# EAGLE design Switch-220v-HiLink-CC1101-AS07 (EAGLE 8.2.1)
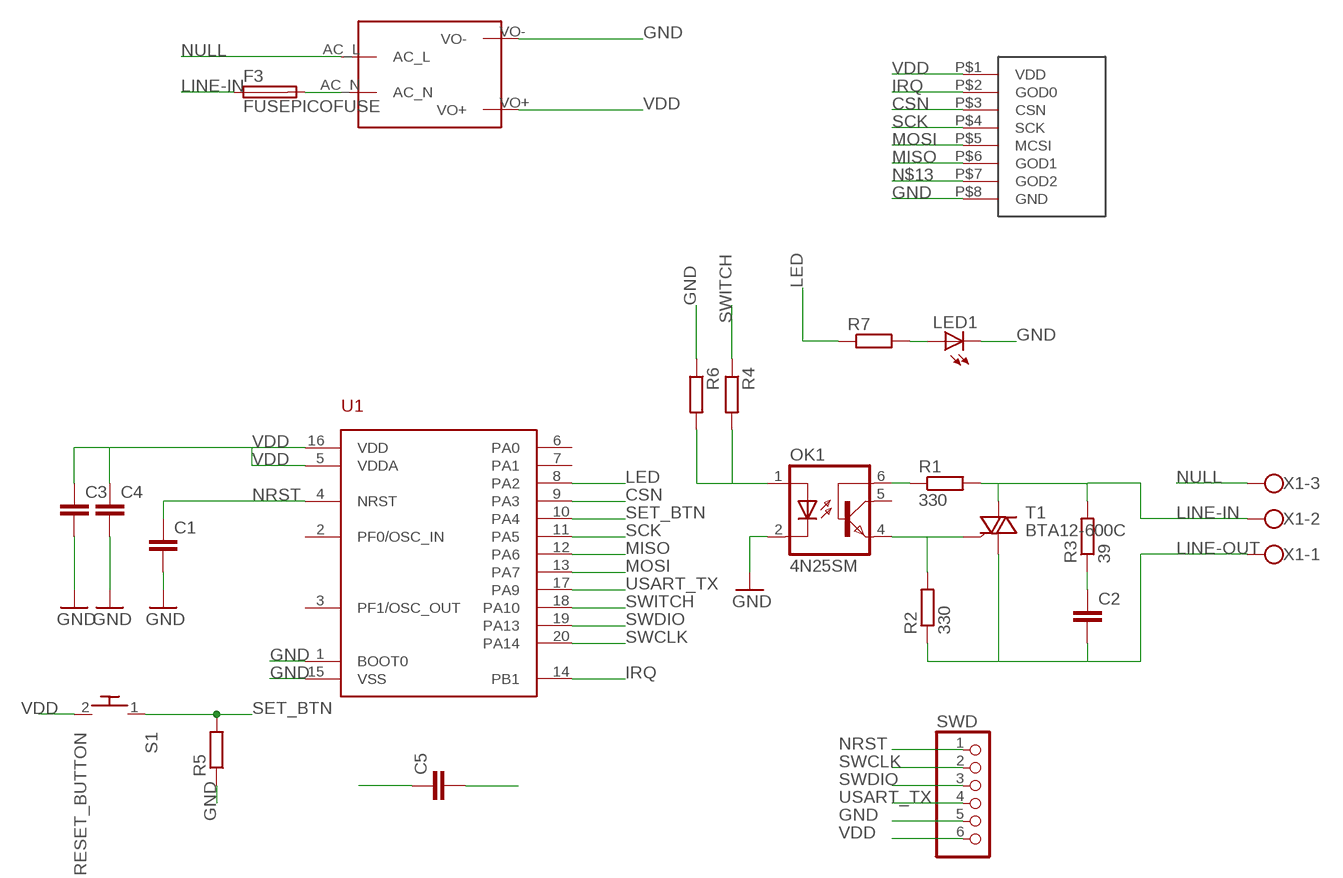
[diagram p0: schematic, sheet 1]

## Parts
C1  C-EUC0805  [C0805]
C2  C-EU050-025X075  [C050-025X075]
C3  C-EUC0805  [C0805]
C4  C-EUC0805  [C0805]
C5  C-EUC0805  [C0805]
F3  FUSEPICOFUSE  [PICOFUSE]
LED1  LEDCHIP-LED0805  [CHIP-LED0805]
OK1  4N25SM  [DIL6-SMD]
R1  330  R-EU_0207/2V  [0207/2V]
R2  330  R-EU_0204/7  [0204/7]
R3  39  R-EU_0204/7  [0204/7]
R4  R-EU_R0805  [R0805]
R5  R-EU_R0805  [R0805]
R6  R-EU_R0805  [R0805]
R7  R-EU_R0805  [R0805]
S1  RESET_BUTTON  [EVQ-PJU05K]
SWD  PINHD-1X6B  [1X06-BIG]
T1  BTA12-600C  [TO220DS]
U1  STM32F030F4  [TSSOP20]
U$2  MAINS_CONVERTERS  [HLK-PM01]
U$4  AS07-M1101SSMD  [AS07-M1101S-SMD]
X1  W237-103  [W237-103]

## Nets
CSN: U1.9(PA3) U$4.P$3(CSN)
GND: C1.2 C3.2 C4.2 C5.1 LED1.C OK1.2(C) R5.1 R6.1 SWD.5 U1.1(BOOT0) U1.15(VSS) U$2.VO- U$4.P$8(GND)
IRQ: U1.14(PB1) U$4.P$2(GOD0)
LED: R7.1 U1.8(PA2)
LINE-IN: F3.1 R1.2 R3.2 T1.A2 X1.2
LINE-OUT: C2.2 R2.1 T1.A1 X1.1
MISO: U1.12(PA6) U$4.P$6(GOD1)
MOSI: U1.13(PA7) U$4.P$5(MCSI)
N$1: OK1.4(EMI) R2.2 T1.G
N$2: OK1.6(BAS) R1.1
N$3: LED1.A R7.2
N$4: F3.2 U$2.AC_N
N$5: C2.1 R3.1
N$6: OK1.1(A) R4.2 R6.2
N$13: U$4.P$7(GOD2)
NRST: C1.1 SWD.1 U1.4(NRST)
NULL: U$2.AC_L X1.3
SCK: U1.11(PA5) U$4.P$4(SCK)
SET_BTN: R5.2 S1.1 U1.10(PA4)
SWCLK: SWD.2 U1.20(PA14)
SWDIO: SWD.3 U1.19(PA13)
SWITCH: R4.1 U1.18(PA10)
USART_TX: SWD.4 U1.17(PA9)
VDD: C3.1 C4.1 C5.2 S1.2 SWD.6 U1.5(VDDA) U1.16(VDD) U$2.VO+ U$4.P$1(VDD)
Unconnected: OK1.5(COL) U1.2(PF0/OSC_IN) U1.3(PF1/OSC_OUT) U1.6(PA0) U1.7(PA1)

## Library data of the parts
C1-C5 = resistor:C-EU: CAPACITOR, European symbol
F3 = fuse:FUSE: Fuse; OC_FARNELL: unknown; OC_NEWARK: unknown
LED1 = led:LED: LED OSRAM: - CHIPLED LG R971, LG N971, LY N971, LG Q971, LY Q971, LO R971, LY R971 LH N974, LH R974 LS Q976, LO Q976, LY Q976 LO Q996 - Hyper CHIPLED LW Q18S LB Q993, LB Q99A, LB R99A - SideLED LS A670, LO A670, LY A670, LG A670, LP A670 LB A673, LV A673, LT A673, LW A673 LH A674 LY A675 LS A676, LA A676, LO A676, LY A676, LW A676 LS A679, LY A679, LG A679 - Hyper Micro SIDELED® LS Y876, LA Y876, LO Y876, LY Y876 LT Y87S - SmartLED LW L88C, LW L88S LB L89C, LB L89S, LG L890 LS L89K, LO L89K, LY L89K LS L896, LA L896, LO L896, LY L896 - TOPLED LS T670, LO T670, LY T670, LG T670, LP T670 LSG T670, LSP T670, LSY T670, LOP T670, LYG T670 LG T671, LOG T671, LSG T671 LB T673, LV T673, LT T673, LW T673 LH T674 LS T676, LA T676, LO T676, LY T676, LB T676, LH T676, LSB T676, LW T676 LB T67C, LV T67C, LT T67C, LS T67K, LO T67K, LY T67K, LW E67C LS E67B, LA E67B, LO E67B, LY E67B, LB E67C, LV E67C, LT E67C LW T67C LS T679, LY T679, LG T679 LS T770, LO T770, LY T770, LG T770, LP T770 LB T773, LV T773, LT T773, LW T773 LH T774 LS E675, LA E675, LY E675, LS T675 LS T776, LA T776, LO T776, LY T776, LB T776 LHGB T686 LT T68C, LB T68C - Hyper Mini TOPLED® LB M676 - Mini TOPLED Santana® LG M470 LS M47K, LO M47K, LY M47K Source: http://www.osram.convergy.de LUXEON: - LUMILED® LXK2-PW12-R00, LXK2-PW12-S00, LXK2-PW14-U00, LXK2-PW14-V00 LXK2-PM12-R00, LXK2-PM12-S00, LXK2-PM14-U00 LXK2-PE12-Q00, LXK2-PE12-R00, LXK2-PE12-S00, LXK2-PE14-T00, LXK2-PE14-U00 LXK2-PB12-K00, LXK2-PB12-L00, LXK2-PB12-M00, LXK2-PB14-N00, LXK2-PB14-P00, LXK2-PB14-Q00 LXK2-PR12-L00, LXK2-PR12-M00, LXK2-PR14-Q00, LXK2-PR14-R00 LXK2-PD12-Q00, LXK2-PD12-R00, LXK2-PD12-S00 LXK2-PH12-R00, LXK2-PH12-S00 LXK2-PL12-P00, LXK2-PL12-Q00, LXK2-PL12-R00 Source: www.luxeon.com KINGBRIGHT: KA-3528ASYC Source: www.kingbright.com
OK1 = optocoupler:4N*?M: General Purpose 6-Pin Phototransistor Optocouplers Source: http://www.fairchildsemi.com/ds/4N/4N35-M.pdf; MF: FAIRCHILD SEMICONDUCTOR; MPN: 4N25SM; OC_FARNELL: 1021152; OC_NEWARK: 34C2020
R1-R7 = resistor:R-EU_: RESISTOR, European symbol
S1 = m-pad-2.1:RESET_BUTTON
SWD = adafruit:PINHD-1X6: PIN HEADER
T1 = my_components:BTA12: TRIAC
U1 = stm32f030f4:STM32F030F4
U$2 = captain-slow:MAINS_CONVERTERS
U$4 = RemoteSwitchComponents:AS07-M1101S
X1 = con-wago-500:W237-103: WAGO SCREW CLAMP; MPN: 237-103; OC_FARNELL: unknown; OC_NEWARK: 18M7116

## Board
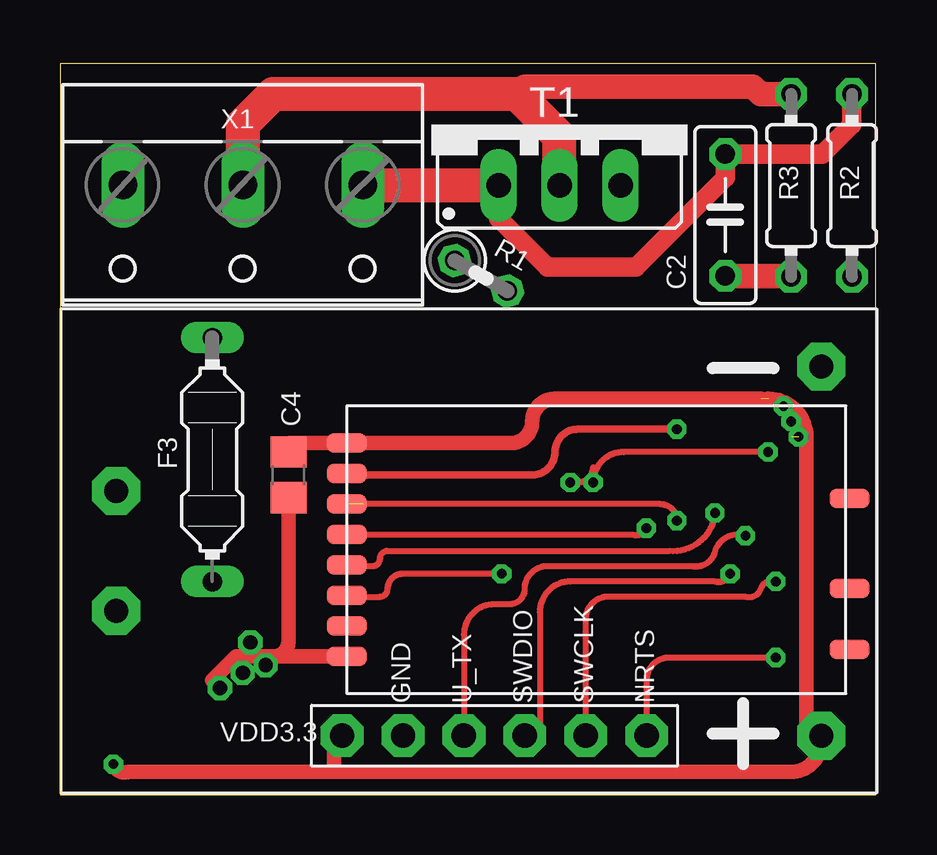
[diagram p1: board, top side]
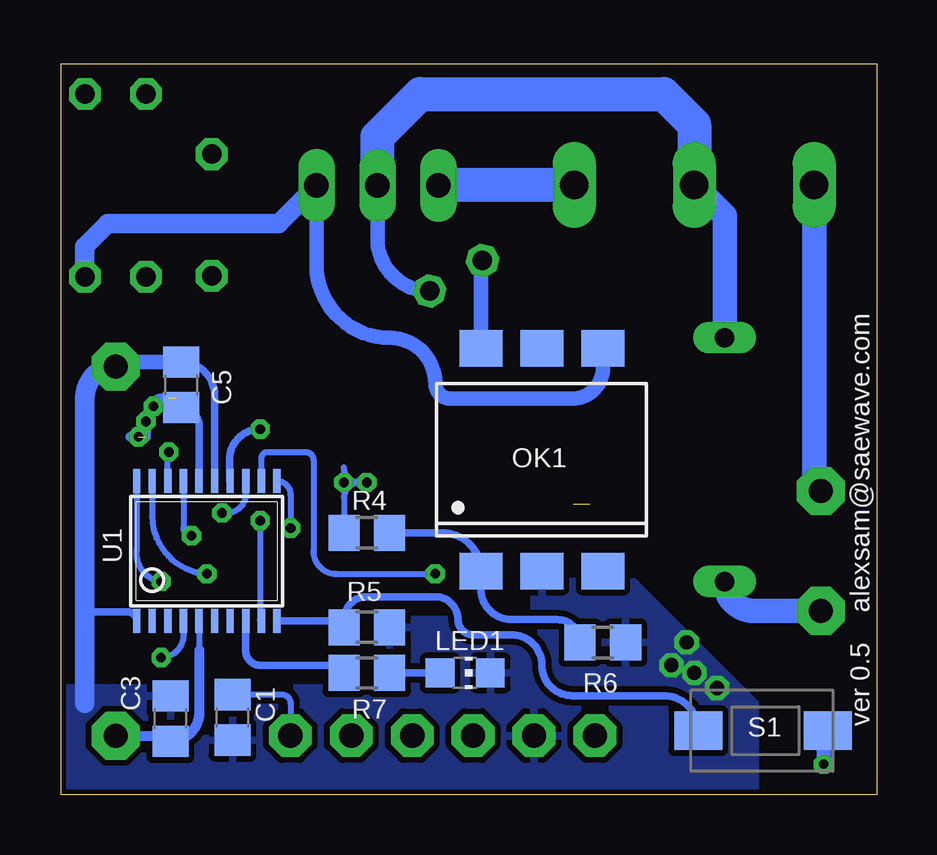
[diagram p2: board, bottom side, seen from below]

Size 34 x 30.47 mm. Coordinates in mm from the lower left corner, seen from the top.
Outline: 0,0 34,0 34,30.47 0,30.47 0,0
Copper layers (1*16): Top 0.035mm / dielectric 1.5mm / Bottom 0.035mm
Design rules "default *": minimum track width 10mil, minimum drill 14mil, track to track 10mil, track to pad 8mil, pad to pad 8mil, via to via 8mil, smd to smd 8mil, copper to edge 8mil, drill to drill 8mil, minimum pad ring 10mil, minimum via ring 8mil, stop-mask expansion 4mil, vias tented up to drill 30mil, thermal gap 10mil
bRestrict: area 14.6,7.6 to 31.1,17.1

### Footprints (pad centres in the part's own frame; a part is rotated, then mirrored left to right if it is on the bottom)
C0805 = smd 1.3 x 1.5: 1 -0.95,0; 2 0.95,0
C050-025X075 = drill 0.813 octagon: 1 -2.54,0; 2 2.54,0
PICOFUSE = drill 0.813 long: 1 -5.08,0; 2 5.08,0
CHIP-LED0805 = smd 1.2 x 1.2: A 0,-1.05; C 0,1.05
DIL6-SMD = smd 1.78 x 1.52: 1 -2.54,-4.645; 2 0,-4.645; 3 2.54,-4.645; 4 2.54,4.645; 5 0,4.645; 6 -2.54,4.645
0207/2V = drill 0.813 octagon: 1 -1.27,0; 2 1.27,0
0204/7 = drill 0.813 octagon: 1 -3.81,0; 2 3.81,0
R0805 = smd 1.3 x 1.5: 1 -0.95,0; 2 0.95,0
EVQ-PJU05K = smd 1.6 x 2: 1 0,2.7; 2 0,-2.7
1X06-BIG = drill 1.016 pad 1.778 octagon: 1 -6.35,0; 2 -3.81,0; 3 -1.27,0; 4 1.27,0; 5 3.81,0; 6 6.35,0
TO220DS = drill 1.016 long: A1 -2.54,-2.54; A2 0,-2.54; G 2.54,-2.54
TSSOP20 = smd 0.305 x 0.991: 1 -2.925,-2.918; 2 -2.275,-2.918; 3 -1.625,-2.918; 4 -0.975,-2.918; 5 -0.325,-2.918; 6 0.325,-2.918; 7 0.975,-2.918; 8 1.625,-2.918; 9 2.275,-2.918; 10 2.925,-2.918; 11 2.925,2.918; 12 2.275,2.918; 13 1.625,2.918; 14 0.975,2.918; 15 0.325,2.918; 16 -0.325,2.918; 17 -0.975,2.918; 18 -1.625,2.918; 19 -2.275,2.918; 20 -2.925,2.918
HLK-PM01 = drill 1 pad 2 octagon: AC_L -14.7,2.5; AC_N -14.7,-2.5; VO+ 14.7,-7.7; VO- 14.7,7.7
AS07-M1101S-SMD = smd 1.676 x 0.813: P$1 -10.16,4.09; P$2 -10.16,2.82; P$3 -10.16,1.55; P$4 -10.16,0.28; P$5 -10.16,-0.99; P$6 -10.16,-2.26; P$7 -10.16,-3.53; P$8 -10.16,-4.8; P$9 10.795,1.79; P$10 10.795,-1.96; P$11 10.795,-4.5
W237-103 = drill 1.194 long: 1 -5,-1.29; 2 0,-1.29; 3 5,-1.29

### Placement (x,y rotation side)
C1  26.87,3.23 270 bottom
C2  27.74,24.17 90 top
C3  29.45,3.17 90 bottom
C4  9.53,13.34 270 top
C5  29.01,17.09 270 bottom
F3  6.35,13.97 270 top
LED1  17.17,5.08 270 bottom
OK1  13.97,13.97 0 bottom
R1  17.55,21.64 330 top
R2  33.02,25.4 270 top
R3  30.48,25.4 90 top
R4  21.27,10.92 0 bottom
R5  21.27,6.99 180 bottom
R6  11.43,6.35 180 bottom
R7  21.27,5.08 0 bottom
S1  4.75,2.67 90 bottom
SWD  18.11,2.46 180 top
T1  20.83,27.94 0 top
U1  27.94,10.16 0 bottom
U$2  17.04,10.16 0 top
U$4  22.12,10.57 0 top
X1  7.62,24.13 180 top

### Tracks (layer width: path | path; a pad name or v marks a point on that pad's centre or on a via)
CSN  (via drill 0.4)  (1 unrouted)
  Top 0.254: v25.72,11.43 arc90 25.03,12.12 12.75,12.12 arc90 12.7,12.06 arc90 12.65,12.12
  Bottom 0.254: v25.72,11.43 25.72,7.29 arc-90 U1.9
GND  (via drill 0.6)
  Top 0.61: U$4.P$8 8.89,5.77 | 8.89,5.77 7.35,5.77 6.35,4.76 v6.67,4.45 | C4.2 9.53,6.4 arc-90 8.89,5.77
  Bottom 0.305: U1.15 27.61,16.65 arc-90 C5.1 | U1.1 arc-90 31.24,7.62 33.02,7.62
  Bottom 0.61: C5.1 31.56,18.04 arc-90 U$2.VO-
  Bottom 0.813: U$2.VO- arc-90 33.02,16.58 33.02,7.62 33.02,3.81
  other vias: 7.62,5.08 8.57,5.4 7.94,6.35
  pour Bottom: 34.29,0 33.97,4.45 21.27,4.45 20.32,8.89 10.16,8.89 5.08,3.81 5.08,0
IRQ  (via drill 0.4)
  Top 0.254: 12.02,13.34 arc-90 U$4.P$2
  Top 0.305: 12.02,13.34 19.68,13.34 arc90 20.64,14.29 arc-90 21.59,15.24 v25.72,15.24
  Bottom 0.254: 26.99,13.1 arc-90 U1.14
  Bottom 0.305: 26.99,13.1 26.99,13.97 arc90 v25.72,15.24
LED
  Bottom 0.305: U1.8 26.32,6 arc-90 25.72,5.4 22.54,5.4 arc90 R7.1
LINE-IN
  Top 1.016: R3.2 29.21,29.21 28.89,29.53 19.37,29.53 19.05,29.21
  Top 1.422: T1.A2 20.83,27.43 19.05,29.21 8.89,29.21 7.62,27.94 7.62,25.4
  Bottom 0.61: T1.A2 20.83,23.18 arc-90 R1.2
  Bottom 1.016: X1.2 6.35,24.15 F3.1
  Bottom 1.422: T1.A2 20.83,27.43 19.05,29.21 8.89,29.21 7.62,27.94 X1.2
LINE-OUT
  Top 0.813: T1.A1 18.29,24.03 20.32,22 24,22 27.74,25.73 C2.2 31.79,26.71 33.02,27.94 R2.1
  Top 1.422: T1.A1 12.7,25.4
  Bottom 0.406: 18.27,25.42 T1.A1
  Bottom 1.422: X1.1 18.27,25.42
MISO  (via drill 0.4)
  Top 0.254: v18.41,9.21 14.29,9.21 arc90 13.65,8.57 arc-90 13.34,8.26 12.02,8.26 arc-90 U$4.P$6
  Bottom 0.254: U1.12 25.66,14.02 arc90 25.4,14.29 23.81,14.29 arc90 23.5,13.97 23.5,10.16 arc-90 22.54,9.21 v18.41,9.21
MOSI  (via drill 0.4)
  Top 0.254: U$4.P$5 arc90 12.02,9.53 13.02,9.53 arc90 13.34,9.84 arc-90 13.65,10.16 25.4,10.16 arc90 v27.3,11.75
  Bottom 0.254: U1.13 26.32,12.42 arc90 v27.3,11.75
N$1
  Bottom 0.61: OK1.4 11.43,17.78 arc90 12.7,16.51 17.78,16.51 arc90 18.41,17.14 arc-90 20.32,19.05 arc90 23.37,22.1 T1.G
  Bottom 0.813: R2.2 33.02,22.86 32.07,23.81 24.96,23.81 T1.G
N$2
  Bottom 0.61: OK1.6 16.51,22.22 arc90 R1.1
N$3
  Bottom 0.305: LED1.A R7.2
N$4
  Bottom 1.016: U$2.AC_N 5.12,7.66 arc90 F3.2
N$5
  Top 1.016: C2.1 30.44,21.63 R3.1
N$6
  Bottom 0.305: R4.2 18.11,10.92 arc90 OK1.1 16.51,8.57 arc-90 15.24,7.3 13.33,7.3 arc90 R6.2
N$7  (via drill 0.4)
  other vias: 21.27,13.02
NRST  (via drill 0.4)
  Top 0.254: v29.84,5.71 25.4,5.71 arc90 24.45,4.76 24.45,1.84 arc90 SWD.1
  Bottom 0.254: U1.4 28.91,6.64 arc90 v29.84,5.71 | C1.1 24.81,4.18 arc90 24.45,3.81 24.45,1.84 arc90 SWD.1
NULL
  Bottom 1.016: X1.3 2.62,12.94 U$2.AC_L
SCK  (via drill 0.4)
  Top 0.254: U$4.P$4 23.86,10.85 arc90 v24.45,11.11
  Bottom 0.254: U1.11 arc90 24.45,12.51 v24.45,11.11
SET_BTN
  Bottom 0.305: U1.10 22.48,7.24 arc90 R5.2 22.22,7.3 arc90 21.27,8.26 18.41,8.26 arc90 17.46,7.3 arc-90 16.83,6.67 15.24,6.67 arc90 13.97,5.4 arc-90 12.7,4.13 8.91,4.13 arc90 S1.1
SWCLK  (via drill 0.4)
  Top 0.254: v29.84,8.89 arc90 29.21,8.57 arc-90 28.57,8.26 22.86,8.26 arc90 21.91,7.3 21.91,1.84 arc90 SWD.2
  Bottom 0.254: U1.20 30.86,10.23 arc-90 v29.84,8.89
SWDIO  (via drill 0.4)
  Top 0.254: v27.94,9.21 arc-90 27.3,8.89 21.27,8.89 arc90 20,7.62 20,2.45 arc-90 SWD.3
  Bottom 0.254: U1.19 30.21,11.8 arc-90 v27.94,9.21
SWITCH  (via drill 0.4)
  Top 0.254: v29.53,14.29 23.5,14.29 arc90 v22.23,13.02 | 22.23,13.65 arc-90 21.59,13.02 v21.27,13.02
  Bottom 0.254: U1.18 29.57,14.25 arc90 v29.53,14.29 | 22.23,12.38 v22.23,13.02 arc-90 v22.22,13.02 | 22.23,12.38 R4.1 arc-90 R4.1 | 21.59,13.02 arc90 22.23,13.65 | 21.59,13.02 arc-90 22.23,12.38 | v21.27,13.02 21.59,13.02 | 21.59,13.02 arc-90 22.23,12.38
USART_TX  (via drill 0.4)
  Top 0.254: v28.57,10.79 arc90 27.3,10.16 arc-90 26.35,9.53 20.32,9.53 arc90 19.37,8.57 arc-90 18.73,7.94 18.1,7.94 arc90 16.84,6.68 SWD.4
  Bottom 0.254: U1.17 28.91,11.13 arc-90 v28.57,10.79
VDD  (via drill 0.4)  (4 unrouted)
  Top 0.305: U$2.VO+ 31.74,2.22
  Top 0.61: 29.53,16.51 arc-90 31.11,14.92 31.11,3.09 arc90 U$2.VO+ | 31.74,2.22 arc-90 30.48,0.95 11.43,0.95 | 11.43,0.95 2.86,0.95 arc-90 v2.22,1.27 | SWD.6 11.43,2.46 11.43,0.95 | 29.21,16.51 20.64,16.51 arc90 19.68,15.56 arc-90 18.78,14.66 U$4.P$1 9.58,14.66 arc90 C4.1
  Bottom 0.254: U1.5 28.27,6.04 arc-90 28.26,6.03
  Bottom 0.305: 2.22,2.49 arc90 S1.2 | U1.16 28.27,15.4 arc-90 C5.2
  Bottom 0.406: U$2.VO+ 29.69,2.46 arc90 C3.1 arc-90 28.26,3.42 28.26,6.03 | C5.2 29.01,16.31 arc-90 29.21,16.51 | v30.16,16.19 arc90 29.84,16.51 29.53,16.51 arc-90 v30.48,15.56 30.48,14.92 31.11,14.92
  Bottom 0.61: v2.22,1.27 2.22,2.49
  other vias: 30.8,14.92

### Text on the board
tNames: GND | U_TX | SWDIO | SWCLK | NRTS | VDD3.3
bNames: ver 0.5 alexsam@saewave.com